# EAGLE design hw2 (EAGLE 7.5.0)
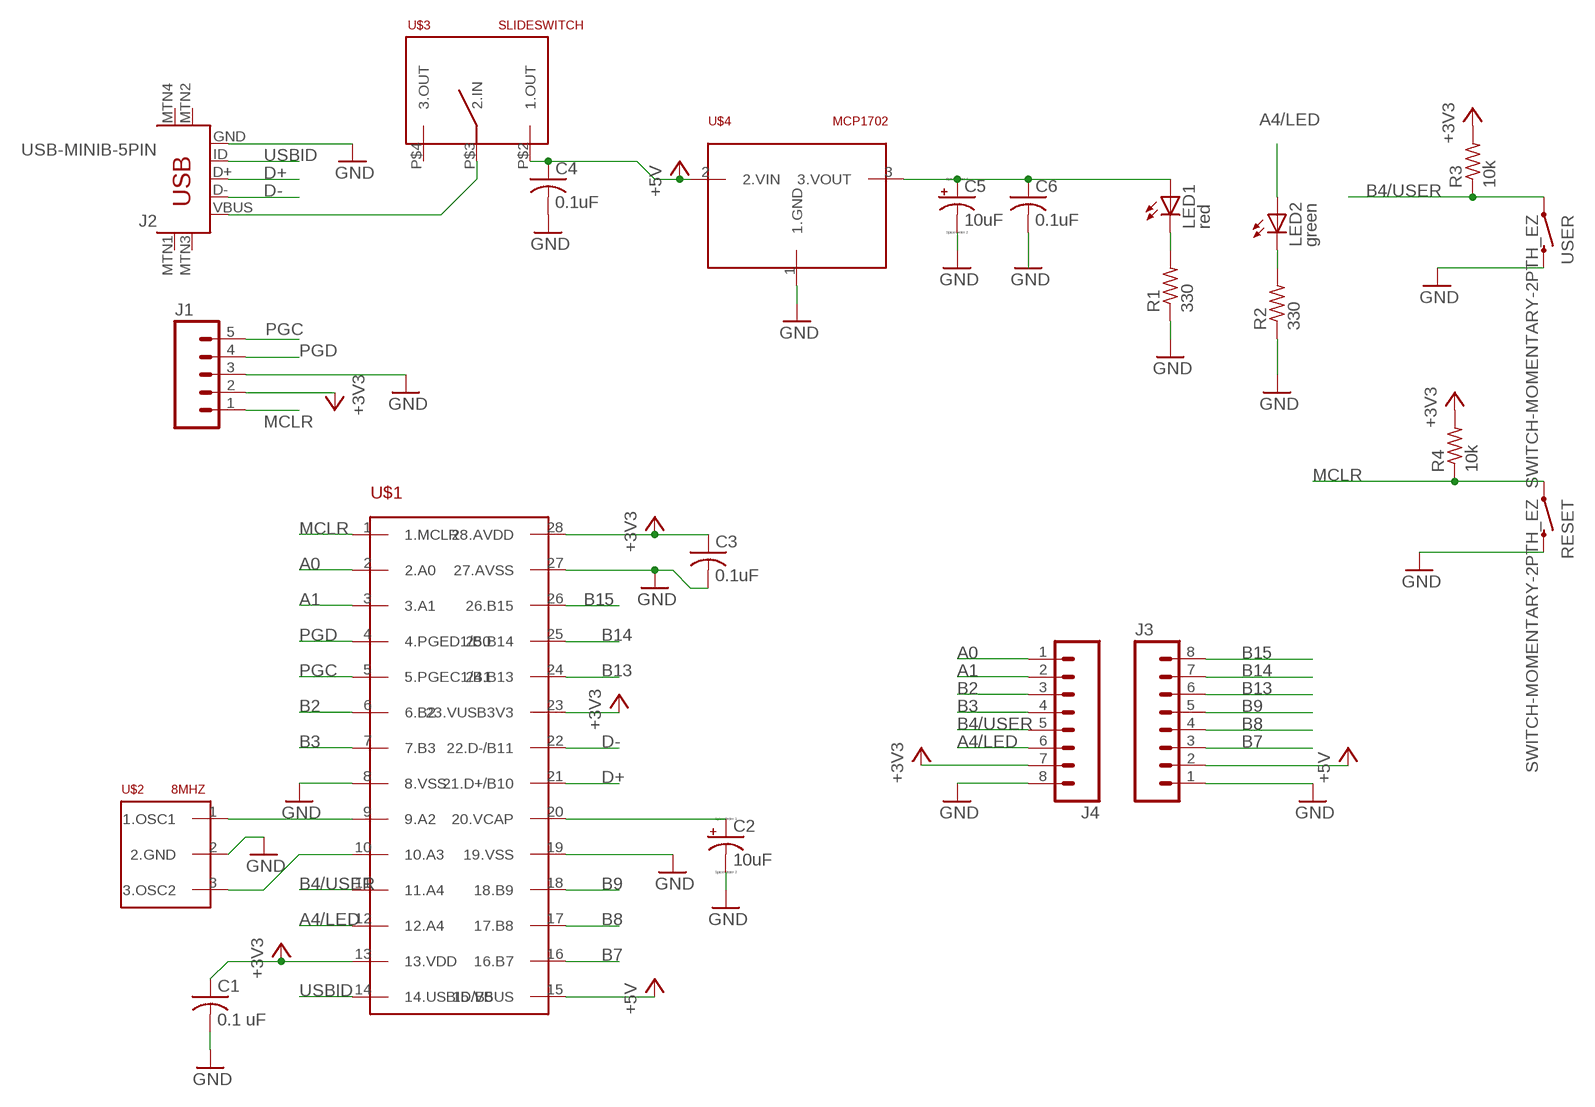
[diagram p0: schematic, sheet 1]

## Parts
C1  0.1 uF  C-US025-024X044  [C025-024X044]
C2  10uF  CPOL-US085CS-1AR  [085CS_1AR]
C3  0.1uF  C-US025-024X044  [C025-024X044]
C4  0.1uF  C-US025-024X044  [C025-024X044]
C5  10uF  CPOL-US085CS-1AR  [085CS_1AR]
C6  0.1uF  C-US025-024X044  [C025-024X044]
J1  M05PTH  [1X05]
J2  USB-MINIB-5PIN  [USB-MINIB]
J3  M08  [1X08_ROUND]
J4  M08  [1X08_ROUND]
LED1  red  LED3MM  [LED3MM]
LED2  green  LED3MM  [LED3MM]
R1  330  R-US_0207/10  [0207/10]
R2  330  R-US_0207/10  [0207/10]
R3  10k  R-US_0207/10  [0207/10]
R4  10k  R-US_0207/10  [0207/10]
RESET  SWITCH-MOMENTARY-2PTH_EZ  [TACTILE-PTH-EZ]
U$1  PIC32MX250F128B  [DIL28-3]
U$2  8MHZ  [RESONATOR-PTH]
U$3  SLIDESWITCH  [SLIDESWITCH]
U$4  MCP1702  [TO92]
USER  SWITCH-MOMENTARY-2PTH_EZ  [TACTILE-PTH-EZ]

## Nets
+3V3: C1.1 C3.1 J1.2 J4.7 R3.2 R4.2 U$1.13(13.VDD) U$1.23(23.VUSB3V3) U$1.28(28.AVDD)
+5V: C4.1 J3.2 U$1.15(15.VBUS) U$3.P$2(1.OUT) U$4.2(2.VIN)
A0: J4.1 U$1.2(2.A0)
A1: J4.2 U$1.3(3.A1)
A4/LED: J4.6 LED2.A U$1.12(12.A4)
B2: J4.3 U$1.6(6.B2)
B3: J4.4 U$1.7(7.B3)
B4/USER: J4.5 R3.1 U$1.11(11.A4) USER.1
B7: J3.3 U$1.16(16.B7)
B8: J3.4 U$1.17(17.B8)
B9: J3.5 U$1.18(18.B9)
B13: J3.6 U$1.24(24.B13)
B14: J3.7 U$1.25(25.B14)
B15: J3.8 U$1.26(26.B15)
D+: J2.D+ U$1.21(21.D+/B10)
D-: J2.D- U$1.22(22.D-/B11)
GND: C1.2 C2.- C3.2 C4.2 C5.- J1.3 J2.GND J3.1 J4.8 R1.1 R2.1 RESET.3 U$1.8(8.VSS) U$1.19(19.VSS) U$1.27(27.AVSS) U$2.2(2.GND) U$4.1(1.GND) USER.3
MCLR: J1.1 R4.1 RESET.1 U$1.1(1.MCLR)
N$1: U$1.9(9.A2) U$2.1(1.OSC1)
N$2: U$1.10(10.A3) U$2.3(3.OSC2)
N$3: J2.VBUS U$3.P$3(2.IN)
N$4: LED1.K(C) R1.2
N$5: C5.+ C6.1 LED1.A U$4.3(3.VOUT)
N$6: C6.2
N$8: LED2.K(C) R2.2
N$27: C2.+ U$1.20(20.VCAP)
PGC: J1.5 U$1.5(5.PGEC1/B1)
PGD: J1.4 U$1.4(4.PGED1/B0)
USBID: J2.ID U$1.14(14.USBID/B5)
Unconnected: J2.MTN1(MTN2) J2.MTN2(MTN3) J2.MTN3(MTN1) J2.MTN4 U$3.P$4(3.OUT)

## Library data of the parts
C1 C3 C4 C6 = hw2_library:C-US: CAPACITOR, American symbol
C2 C5 = hw2_library:CPOL-US: POLARIZED CAPACITOR, American symbol
J1 = hw2_library:M05: Header 5 Standard 5-pin 0.1" header. Use with straight break away headers (SKU : PRT-00116), right angle break away headers (PRT-00553), swiss pins (PRT-00743), machine pins (PRT-00117), and female headers (PRT-00115). Molex polarized connector foot print use with SKU : PRT-08230 with associated crimp pins and housings.
J2 = hw2_library:USB-MINIB: Mini-USB "B" connector with 5th pin broken out. Created new symbol breaking out 5th "ID" pin in mini/micro USB connector spec. See: http://en.wikipedia.org/wiki/Mini_usb#Cables. Uses same footprint as 4-pin symbol. Also added pins to connect to mounting / shield pads if required (probably not generally needed as signals aren't shielded once they leave the connector).; PROD_ID: CONN-08193
J3 J4 = hw2_library:M08: Header 8 Standard 8-pin 0.1" header. Use with straight break away headers (SKU : PRT-00116), right angle break away headers (PRT-00553), swiss pins (PRT-00743), machine pins (PRT-00117), and female headers (PRT-00115).; PROD_ID: CONN-08437
LED1 LED2 = led:LED: LED OSRAM: - CHIPLED LG R971, LG N971, LY N971, LG Q971, LY Q971, LO R971, LY R971 LH N974, LH R974 LS Q976, LO Q976, LY Q976 LO Q996 - Hyper CHIPLED LW Q18S LB Q993, LB Q99A, LB R99A - SideLED LS A670, LO A670, LY A670, LG A670, LP A670 LB A673, LV A673, LT A673, LW A673 LH A674 LY A675 LS A676, LA A676, LO A676, LY A676, LW A676 LS A679, LY A679, LG A679 - Hyper Micro SIDELED® LS Y876, LA Y876, LO Y876, LY Y876 LT Y87S - SmartLED LW L88C, LW L88S LB L89C, LB L89S, LG L890 LS L89K, LO L89K, LY L89K LS L896, LA L896, LO L896, LY L896 - TOPLED LS T670, LO T670, LY T670, LG T670, LP T670 LSG T670, LSP T670, LSY T670, LOP T670, LYG T670 LG T671, LOG T671, LSG T671 LB T673, LV T673, LT T673, LW T673 LH T674 LS T676, LA T676, LO T676, LY T676, LB T676, LH T676, LSB T676, LW T676 LB T67C, LV T67C, LT T67C, LS T67K, LO T67K, LY T67K, LW E67C LS E67B, LA E67B, LO E67B, LY E67B, LB E67C, LV E67C, LT E67C LW T67C LS T679, LY T679, LG T679 LS T770, LO T770, LY T770, LG T770, LP T770 LB T773, LV T773, LT T773, LW T773 LH T774 LS E675, LA E675, LY E675, LS T675 LS T776, LA T776, LO T776, LY T776, LB T776 LHGB T686 LT T68C, LB T68C - Hyper Mini TOPLED® LB M676 - Mini TOPLED Santana® LG M470 LS M47K, LO M47K, LY M47K Source: http://www.osram.convergy.de LUXEON: - LUMILED® LXK2-PW12-R00, LXK2-PW12-S00, LXK2-PW14-U00, LXK2-PW14-V00 LXK2-PM12-R00, LXK2-PM12-S00, LXK2-PM14-U00 LXK2-PE12-Q00, LXK2-PE12-R00, LXK2-PE12-S00, LXK2-PE14-T00, LXK2-PE14-U00 LXK2-PB12-K00, LXK2-PB12-L00, LXK2-PB12-M00, LXK2-PB14-N00, LXK2-PB14-P00, LXK2-PB14-Q00 LXK2-PR12-L00, LXK2-PR12-M00, LXK2-PR14-Q00, LXK2-PR14-R00 LXK2-PD12-Q00, LXK2-PD12-R00, LXK2-PD12-S00 LXK2-PH12-R00, LXK2-PH12-S00 LXK2-PL12-P00, LXK2-PL12-Q00, LXK2-PL12-R00 Source: www.luxeon.com KINGBRIGHT: KA-3528ASYC Source: www.kingbright.com
R1-R4 = hw2_library:R-US_: RESISTOR, American symbol
RESET USER = hw2_library:SWITCH-MOMENTARY-2: Various NO switches- pushbuttons, reed, etc
U$1 = hw2_library:PIC32MX250F128B
U$2 = hw2_library:8MHZ
U$3 = hw2_library:SLIDESWITCH
U$4 = hw2_library:MCP1702

## Board
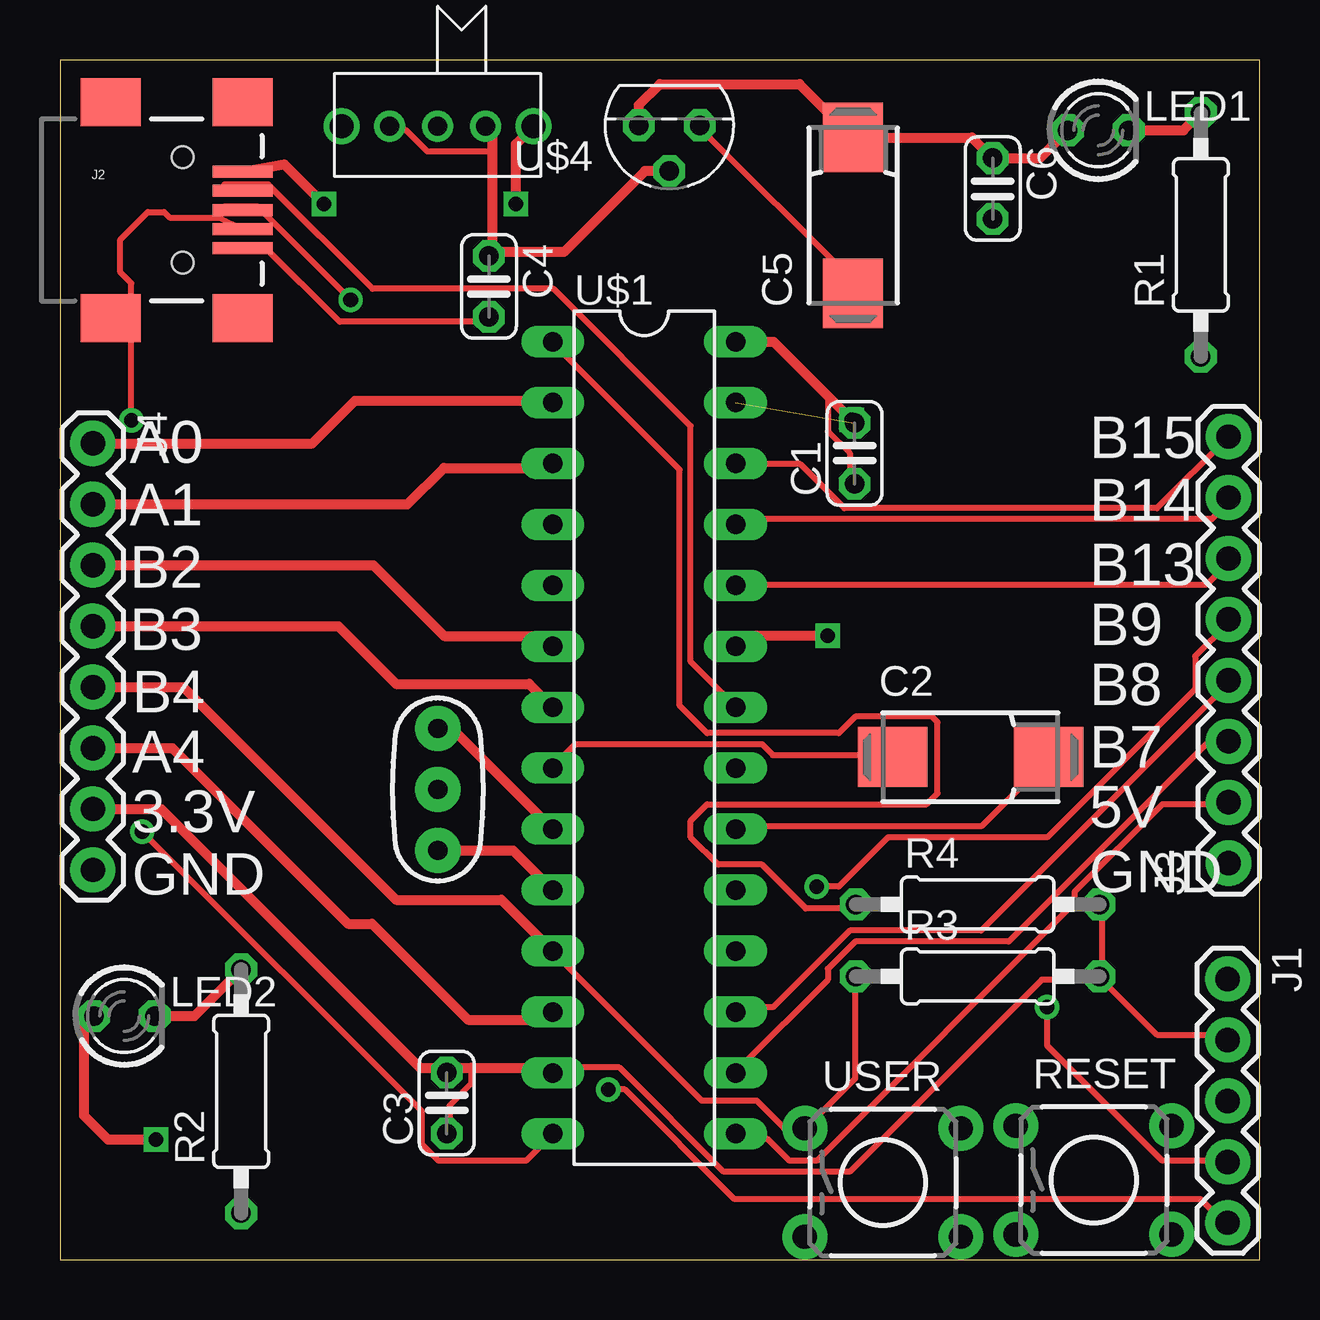
[diagram p1: board, top side]
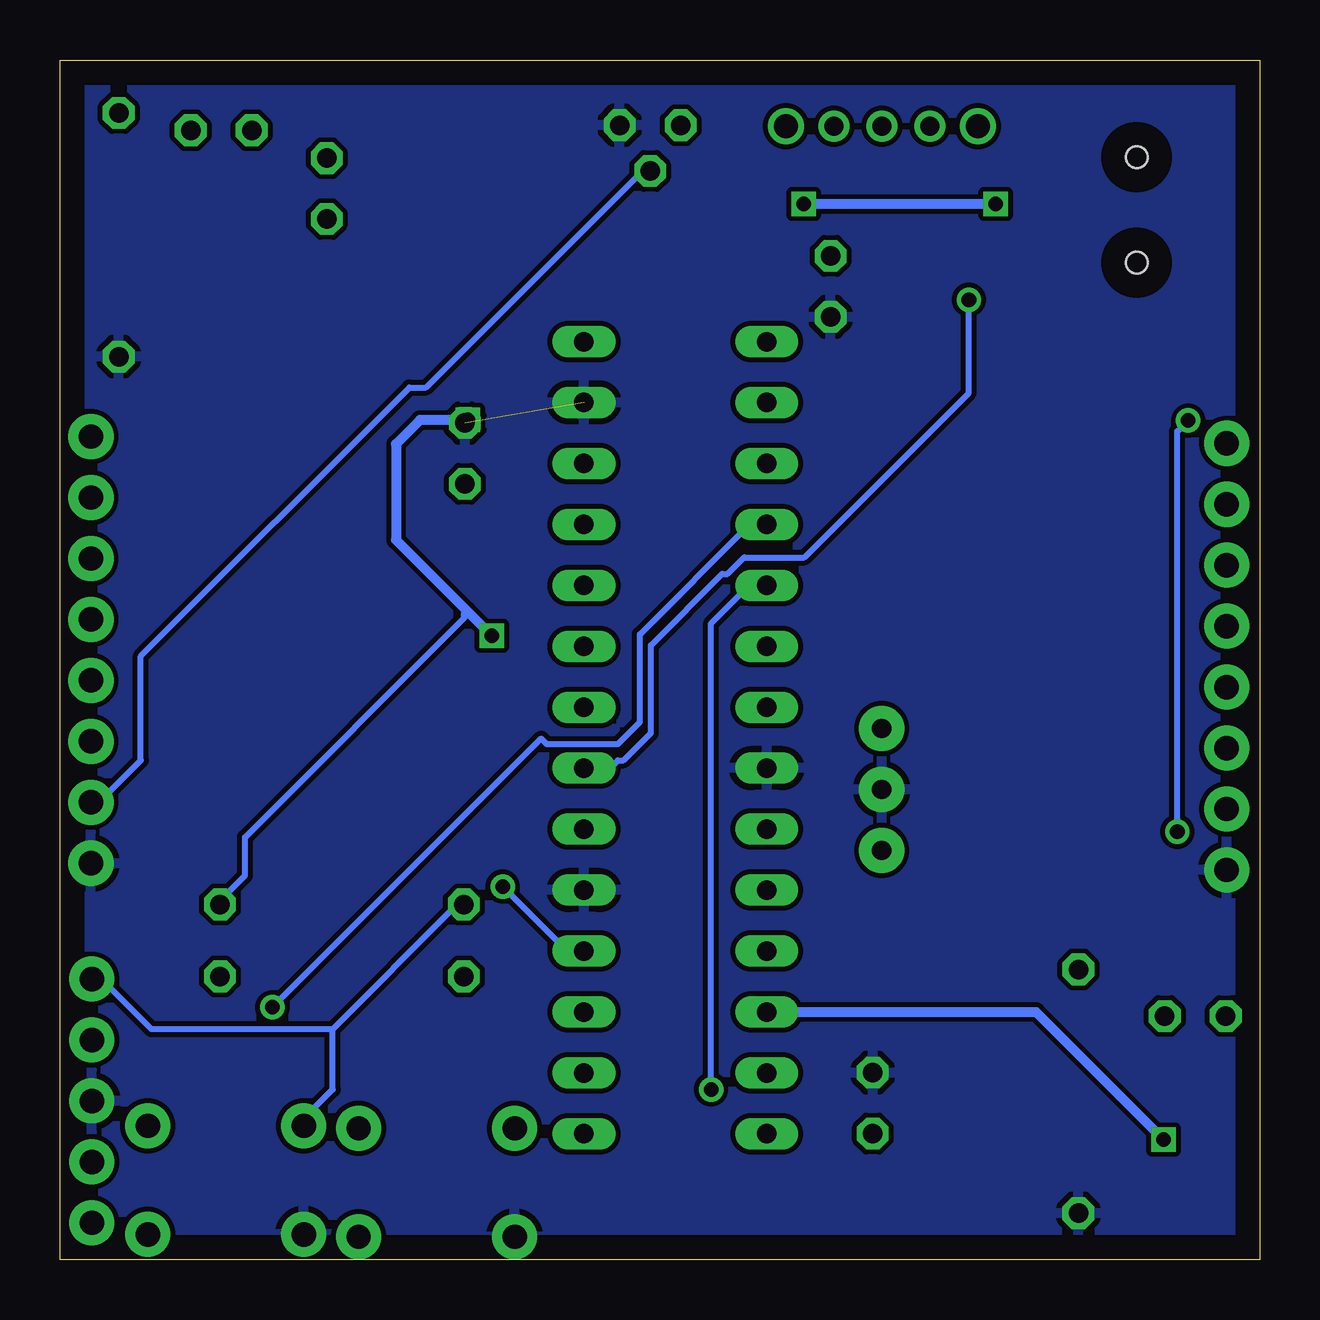
[diagram p2: board, bottom side, seen from below]

Size 50 x 50 mm. Coordinates in mm from the lower left corner, seen from the top.
Outline: 0,0 50,0 50,50 0,50 0,0
Copper layers (1*16): Top 0.035mm / dielectric 1.5mm / Bottom 0.035mm
Design rules "default": minimum track width 10mil, minimum drill 24mil, track to track 8mil, track to pad 8mil, pad to pad 8mil, via to via 8mil, smd to smd 8mil, copper to edge 40mil, drill to drill 8mil, minimum pad ring 10mil, minimum via ring 8mil, stop-mask expansion 4mil, vias tented up to drill 0mil, thermal gap 10mil

### Footprints (pad centres in the part's own frame; a part is rotated, then mirrored left to right if it is on the bottom)
C025-024X044 = drill 0.813 octagon: 1 -1.27,0; 2 1.27,0
085CS_1AR = smd 2.9 x 2.5: + 3.25,0; - -3.25,0
1X05 = drill 1.016 pad 1.88: 1 0,0; 2 2.54,0; 3 5.08,0; 4 7.62,0; 5 10.16,0
USB-MINIB = smd 2.5 x 0.5: D+ 2.5,0; D- 2.5,0.8; GND 2.5,-1.6; ID 2.5,-0.8; VBUS 2.5,1.6 | smd 2.5 x 2: MTN1 -3,4.5; MTN2 2.5,4.5; MTN3 -3,-4.5; MTN4 2.5,-4.5 | hole 0.9: 0,2.2; 0,-2.2
1X08_ROUND = drill 1.016 pad 1.88: 1 0,0; 2 2.54,0; 3 5.08,0; 4 7.62,0; 5 10.16,0; 6 12.7,0; 7 15.24,0; 8 17.78,0
LED3MM = drill 0.813 octagon: A -1.27,0; K 1.27,0
0207/10 = drill 0.813 octagon: 1 -5.08,0; 2 5.08,0
TACTILE-PTH-EZ = drill 1.016 pad 1.88: 1 -3.251,2.261; 2 3.251,2.261; 3 -3.251,-2.261; 4 3.251,-2.261
DIL28-3 = drill 0.813 long: 1 -16.51,-3.81; 2 -13.97,-3.81; 3 -11.43,-3.81; 4 -8.89,-3.81; 5 -6.35,-3.81; 6 -3.81,-3.81; 7 -1.27,-3.81; 8 1.27,-3.81; 9 3.81,-3.81; 10 6.35,-3.81; 11 8.89,-3.81; 12 11.43,-3.81; 13 13.97,-3.81; 14 16.51,-3.81; 15 16.51,3.81; 16 13.97,3.81; 17 11.43,3.81; 18 8.89,3.81; 19 6.35,3.81; 20 3.81,3.81; 21 1.27,3.81; 22 -1.27,3.81; 23 -3.81,3.81; 24 -6.35,3.81; 25 -8.89,3.81; 26 -11.43,3.81; 27 -13.97,3.81; 28 -16.51,3.81
RESONATOR-PTH = drill 0.8 pad 1.88: 1 -2.54,0; 2 0,0; 3 2.54,0
SLIDESWITCH = drill 0.8: P$1 0,0; P$2 -2,0; P$4 2,0 | drill 1: P$3 4,0; P$5 -4,0
TO92 = drill 0.813 octagon: 1 -1.27,0; 2 0,1.905; 3 1.27,0

### Placement (x,y rotation side)
C1  33.12,33.6 90 top
C2  37.95,20.94 0 top
C3  16.12,6.52 90 top
C4  17.88,40.56 270 top
C5  33.06,43.52 90 top
C6  38.88,44.64 270 top
J1  48.67,11.69 270 top
J2  5.12,43.75 0 top
J3  48.71,16.52 90 top
J4  1.37,34.02 270 top
LED1  43.28,47.07 0 top
LED2  2.68,10.15 0 top
R1  47.55,42.71 90 top
R2  7.55,7.01 90 top
R3  38.25,11.8 0 top
R4  38.25,14.8 0 top
RESET  43.09,3.31 0 top
U$1  24.35,21.75 270 top
U$2  15.75,19.59 270 top
U$3  15.74,47.24 0 top
U$4  25.4,47.28 180 top
USER  34.3,3.21 0 top

### Tracks (layer width: path | path; a pad name or v marks a point on that pad's centre or on a via)
+3V3  (via drill 0.6)
  Top 0.254: C1.1 32.92,32.46 32.92,33.6 32,34.52 32,35.89 32.06,35.94 | C3.1 16.23,5.26 16.23,6.4 17.14,7.32 17.14,8 | R3.2 43.43,11.89 43.43,14.63 R4.2 | U$1.13 20.57,8 23.32,8 27.66,3.66 32.92,3.66 40.92,11.66 43.2,11.66 R3.2 | J1.2 48.46,9.37 45.72,9.37 43.43,11.66 R3.2
  Top 0.406: J4.7 4.22,18.78 15,8 17.14,8 20.32,8 U$1.13 | U$1.28 29.74,38.26 32.06,35.94 v33,35 | v32,26 28.6,26 U$1.23
  Bottom 0.254: 33.06,27.06 33.15,26.98 33.15,26.75 42.29,17.6 42.29,16 43.43,14.86 R4.2
  Bottom 0.406: v33,35 35,35 36,34 36,30 33.06,27.06 v32,26
+5V
  Top 0.254: 18,46.18 15.32,46.18 14.4,47.09 13.95,47.09 U$3.P$2 | U$1.15 28.35,5.03 29.49,5.03 30.4,4.12 31.55,4.12 42.29,14.86 42.29,15.32 45.95,18.97 48.69,18.97 J3.2
  Top 0.406: 18,47 18,46.18 18,41.95 C4.1 18.05,42 21,42 24.38,45.38 U$4.2
  Bottom 0.254: U$4.2 25.6,45.26 25.83,45.26 34.75,36.35 35.43,36.35 46.63,25.15 46.63,20.8 48.23,19.2 48.69,19.2 J3.2
A0  (via drill 0.6)
  Top 0.406: v20.46,35.8 12.3,35.8 10.52,34.02 J4.1
  Bottom 0.406: v20.46,35.8 U$1.2
A1
  Top 0.406: J4.2 14.48,31.48 16,33 20.36,33 U$1.3
  Bottom 0.406: 20.36,33 U$1.3
A4/LED  (via drill 0.6)
  Top 0.406: J4.6 4.68,21.32 12,14 13,14 17,10 20.22,10 U$1.12 | v4,5 2,5 1,6 1,9.74 LED2.A
  Bottom 0.406: U$1.12 9.32,10.32 v4,5
B2
  Top 0.406: J4.3 13.06,28.94 16,26 20.1,26 U$1.6
B3
  Top 0.406: J4.4 11.6,26.4 14,24 19.56,24 U$1.7
B4/USER
  Top 0.254: R3.1 33.15,11.66 33.15,7.54 31.09,5.49 USER.1 30.86,5.49 30.18,5.49 29.03,6.63 26.75,6.63 20.57,12.8 U$1.11
  Top 0.406: J4.5 5.14,23.86 14,15 18.4,15 U$1.11
B7
  Top 0.254: U$1.16 28.35,8 32,11.66 32,12.12 33.15,13.26 39.55,13.26 47.78,21.49 48.69,21.49 J3.3
B8
  Top 0.254: U$1.17 28.35,10.52 29.72,10.52 32.92,13.72 38.41,13.72 48.69,24 J3.4
B9  (via drill 0.61)
  Top 0.254: v31.55,15.54 32.46,15.54 34.52,17.6 41.15,17.6 47.32,23.77 47.32,25.15 48.69,26.52 J3.5
  Bottom 0.254: v31.55,15.54 29.03,13.03 28.35,13.03 U$1.18
B13
  Top 0.254: U$1.24 28.35,28.12 47.78,28.12 48.69,29.03 J3.6
B14
  Top 0.254: U$1.25 28.35,30.86 48.01,30.86 48.69,31.55 J3.7
B15
  Top 0.254: U$1.26 28.35,33.15 30.86,33.15 32.69,31.32 45.72,31.32 48.69,34.29 J3.8
D+  (via drill 0.61)
  Top 0.254: v12.12,40.01 8.23,43.89 6.86,43.89 J2.D+
  Bottom 0.254: v12.12,40.01 12.12,36.12 18.97,29.26 21.49,29.26 22.17,28.57 22.4,28.57 25.38,25.6 25.38,21.95 26.52,20.8 26.75,20.8 26.98,20.57 28.12,20.57 U$1.21
D-
  Top 0.254: J2.D- 6.86,44.81 8.69,44.81 13.03,40.46 20.57,40.46 26.29,34.75 26.29,24.92 28.12,23.09 U$1.22
GND  (1 unrouted)
  Top 0.254: J2.GND 6.86,42.29 8.46,42.29 11.66,39.09 17.83,39.09 C4.2 | C2.- 34.52,21.03 29.72,21.03 29.26,21.49 21.49,21.49 20.57,20.57 U$1.8 | C5.- 32.92,40.46 32.92,40.92 26.75,47.09 U$4.1
  pour Bottom (isolate 0.012): -2,52 54,52 54,46 53,46 53,-3 -3,-3 -3,-2 -2,-2
MCLR
  Top 0.254: U$1.1 20.57,38.18 25.83,32.92 25.83,23.09 26.98,21.95 32.46,21.95 33.15,22.63 36.35,22.63 36.58,22.4 36.58,19.43 36.12,18.97 26.98,18.97 26.29,18.29 26.29,17.6 27.43,16.46 29.26,16.46 31.09,14.63 33.15,14.63 R4.1
  Bottom 0.254: 38.63,9.6 33.6,14.63 33.38,14.63 R4.1 | 38.63,9.6 38.63,7.09 40.01,5.71 RESET.1 | 38.63,9.6 46.18,9.6 48.23,11.66 48.46,11.66 J1.1
N$1
  Top 0.406: U$2.1 16.35,22.13 U$1.9
N$2
  Top 0.406: U$2.3 18.89,17.05 U$1.10
N$3  (via drill 0.6)
  Top 0.406: J2.VBUS 9.35,45.65 v11,44 | v19,44 19,46.5 U$3.P$3
  Bottom 0.406: v11,44 v19,44
N$4
  Top 0.406: LED1.K 46.83,47.07 R1.2
N$5
  Top 0.406: U$4.3 24.13,48.13 25,49 30.83,49 C5.+ 38.02,46.77 C6.1 40.85,45.91 LED1.A
N$8
  Top 0.406: LED2.K 5.61,10.15 R2.2
N$27
  Top 0.254: U$1.20 28.35,18.06 38.41,18.06 41.15,20.8 C2.+
PGC  (via drill 0.61)
  Top 0.254: v22.86,7.09 23.55,7.09 28.12,2.52 47.55,2.52 48.46,1.6 J1.5
  Bottom 0.254: v22.86,7.09 22.86,26.52 21.49,27.89 20.57,27.89 U$1.5
PGD  (via drill 0.61)
  Top 0.254: v41.15,10.52 41.15,8.91 45.95,4.12 48.46,4.12 J1.4
  Bottom 0.254: v41.15,10.52 29.95,21.72 29.72,21.49 26.75,21.49 25.83,22.4 25.83,26.06 21.26,30.63 20.57,30.63 U$1.4
USBID  (via drill 0.61)
  Top 0.254: v2.97,34.98 2.97,40.69 2.52,41.15 2.52,42.52 3.66,43.66 4.34,43.66 4.57,43.43 6.63,43.43 J2.ID | v3.43,17.83 15.09,6.17 15.09,4.8 15.77,4.12 19.43,4.12 20.34,5.03 U$1.14
  Bottom 0.254: v2.97,34.98 3.43,34.52 v3.43,17.83

### Text on the board
tNames: A0 | B15 | A1 | B14 | B2 | B13 | B9 | B3 | B4 | B8 | A4 | B7 | 3.3V | 5V | GND | GND